# Altium schematic sheet numeric.SchDoc: Balise Vision - Interfaces numériques
size A3; Author: B Labbe; CompanyName: Oufffteam; DrawnBy: B Labbe; Engineer: B Labbe; Organization: Oufffteam; Address1: L3, 12a Rodborough Rd; Address2: Frenchs Forest; Address3: NSW; Address4: Australia 2086; Revision: A; SheetNumber: 2; SheetTotal: 10; DocumentName: Balise Vision - Interfaces numériques
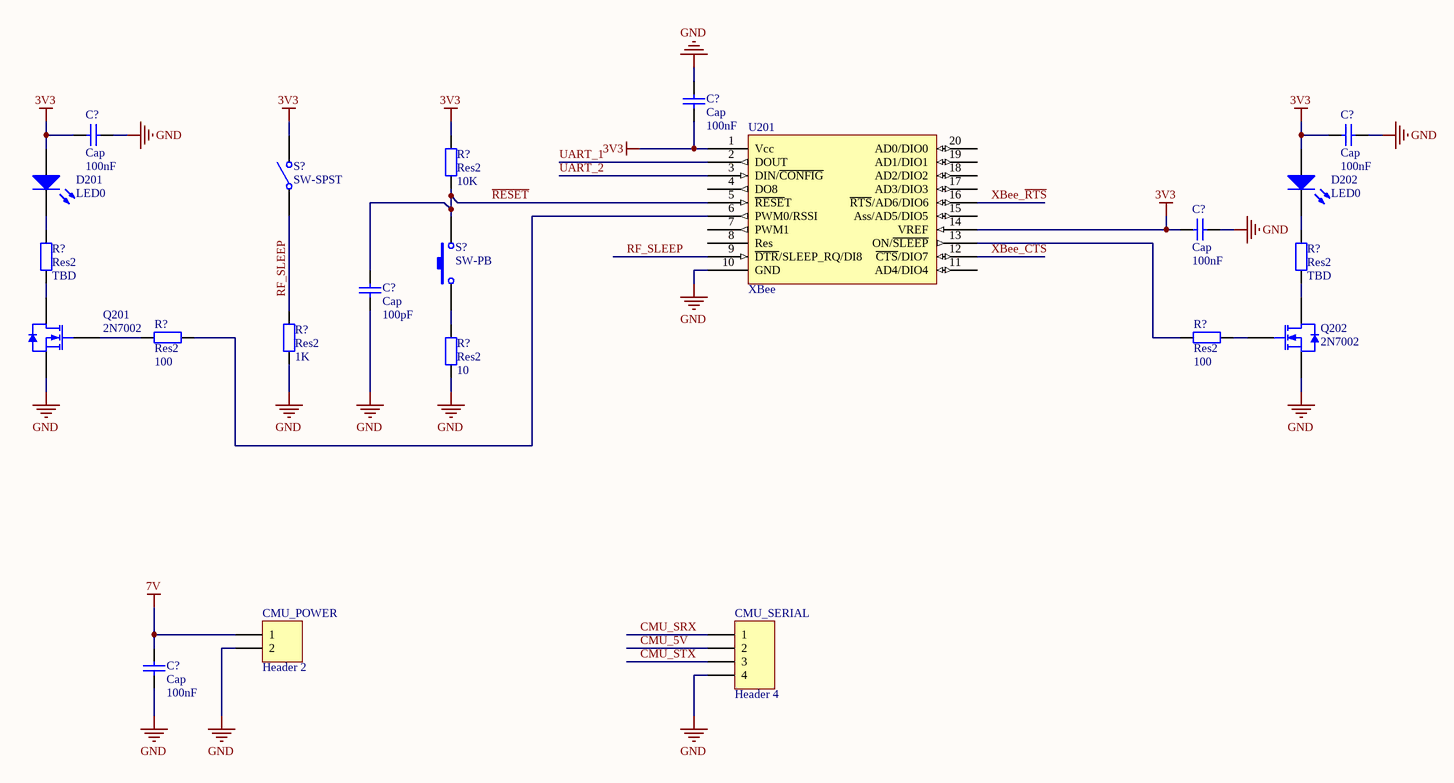
[diagram p0: numeric.SchDoc]

## Parts
(Parts that share a designator on the sheet are numbered #1, #2 ... from top to bottom, then left to right.)
C?#1  Cap  value 100nF  [RAD-0.3]
C?#2  Cap  value 100nF  [RAD-0.3]
C?#3  Cap  value 100nF  [RAD-0.3]
C?#4  Cap  value 100nF  [RAD-0.3]
C?#5  Cap  value 100pF  [RAD-0.3]
C?#6  Cap  value 100nF  [RAD-0.3]
CMU_POWER  Header 2  [HDR1X2]
CMU_SERIAL  Header 4  [HDR1X4]
D201  LED0  [LED-0]
D202  LED0  [LED-0]
Q201  2N7002  [SOT23_N]
Q202  2N7002  [SOT23_N]
R?#1  Res2  value 10K  [AXIAL-0.4]
R?#2  Res2  value TBD  [AXIAL-0.4]
R?#3  Res2  value TBD  [AXIAL-0.4]
R?#4  Res2  value 100  [AXIAL-0.4]
R?#5  Res2  value 100  [AXIAL-0.4]
R?#6  Res2  value 1K  [AXIAL-0.4]
R?#7  Res2  value 10  [AXIAL-0.4]
S?#1  SW-SPST  [SPST-2]
S?#2  SW-PB  [SPST-2]
U201  XBee

## Nets
3V3: C?#1.1 C?#2.1 C?#3.1 C?#4.2 D201.1(A) D202.1(A) R?#1.2 S?#1.2(NO) U201.1(Vcc) U201.14(VREF)
7V: C?#6.2 CMU_POWER.1
GND: C?#1.2 C?#2.2 C?#3.2 C?#4.1 C?#5.1 C?#6.1 CMU_POWER.2 CMU_SERIAL.4 Q201.2(S) Q202.2(S) R?#6.1 R?#7.1 U201.10(GND)
CMU_5V: CMU_SERIAL.2
CMU_SRX: CMU_SERIAL.1
CMU_STX: CMU_SERIAL.3
~{RESET}: C?#5.2 R?#1.1 S?#2.2 U201.5(~{RESE}T)
RF_SLEEP: R?#6.2 S?#1.1(COMMON) U201.9(~{DTR}/SLEEP_RQ/DI8)
UART_1: U201.2(DOUT)
UART_2: U201.3(DIN/~{CONFIG})
XBee_~{CTS}: U201.12(~{CTS}/DIO7)
XBee_~{RTS}: U201.16(~{RTS}/AD6/DIO6)
NetD201_2: D201.2(K) R?#2.2
NetD202_2: D202.2(K) R?#3.2
NetQ201_1: Q201.1(G) R?#4.1
NetQ201_3: Q201.3(D) R?#2.1
NetQ202_1: Q202.1(G) R?#5.2
NetQ202_3: Q202.3(D) R?#3.1
NetR?#4_2: R?#4.2 U201.6(PWM0/RSSI)
NetR?#5_1: R?#5.1 U201.13(ON/~{SLEEP})
NetR?#7_2: R?#7.2 S?#2.1

Not connected (* = marked no-connect by the designer): U201 4(DO8) 7(PWM1) 8(Res) 11(AD4/DIO4) 15(Ass/AD5/DIO5) 17(AD3/DIO3) 18(AD2/DIO2) 19(AD1/DIO1) 20(AD0/DIO0)

## Notes on the sheet
- Title
- Size:
- Date:
- A3
- Number:
- Time:
- Revision:
- Sheet
- of
- Oufffteam
- 3 place Carnot
- 26100
- Romans sur Isère
- oufffteam@gmail.com
- File:

## Library data of the parts
C?#1-C?#6 = Cap: Capacitor; Published: 8-Jun-2000; LatestRevisionDate: 17-Jul-2002; LatestRevisionNote: Re-released for DXP Platform.; PackageReference: RAD-0.3; Publisher: Altium Limited
CMU_POWER = Header 2: Header, 2-Pin; LatestRevisionDate: 17-Jul-2002; LatestRevisionNote: Re-released for DXP Platform.; Publisher: Altium Limited
CMU_SERIAL = Header 4: Header, 4-Pin; LatestRevisionDate: 17-Jul-2002; LatestRevisionNote: Re-released for DXP Platform.; Publisher: Altium Limited
D201 D202 = LED0: Typical INFRARED GaAs LED; Published: 8-Jun-2000; LatestRevisionDate: 08-Jul-2005; LatestRevisionNote: Mech Layer 1 removed.; PackageReference: LED-0; Publisher: Altium Limited
Q201 Q202 = 2N7002: N-channel Enhancement Mode Field-effect Transistor; Published: 17-Sep-2003; LatestRevisionDate: 12-Dec-2006; LatestRevisionNote: IPC-7351 Footprint Added.; DatasheetVersion: 27-Jul-2000; PackageVersion: May-1999; PackageReference: SOT23; Publisher: Altium Limited; PackageDescription: 3-Pin SOT-23 Package 0.95 mm Pitch, 2.3 mm Lead Span; ComponentLink1Description: Manufacturer Link; ComponentLink1URL: http://www.semiconductors.philips.com/; ComponentLink2Description: Datasheet; ComponentLink2URL: http://www.semiconductors.philips.com/acrobat/datasheets/2N7002_4.pdf
R?#1-R?#7 = Res2: Resistor; Published: 8-Jun-2000; LatestRevisionDate: 17-Jul-2002; LatestRevisionNote: Re-released for DXP Platform.; PackageReference: AXIAL-0.4; Publisher: Altium Limited
S?#1 = SW-SPST: Single-Pole, Single-Throw Switch; Published: 24-Mar-1999; LatestRevisionDate: 17-Jul-2002; LatestRevisionNote: Re-released for DXP Platform.; PackageReference: SPST-2; Publisher: Altium Limited
S?#2 = SW-PB: Switch; Published: 24-Mar-1999; LatestRevisionDate: 17-Jul-2002; LatestRevisionNote: Re-released for DXP Platform.; PackageReference: SPST-2; Publisher: Altium Limited